# Altium project Water Heater Chip.PrjPcb
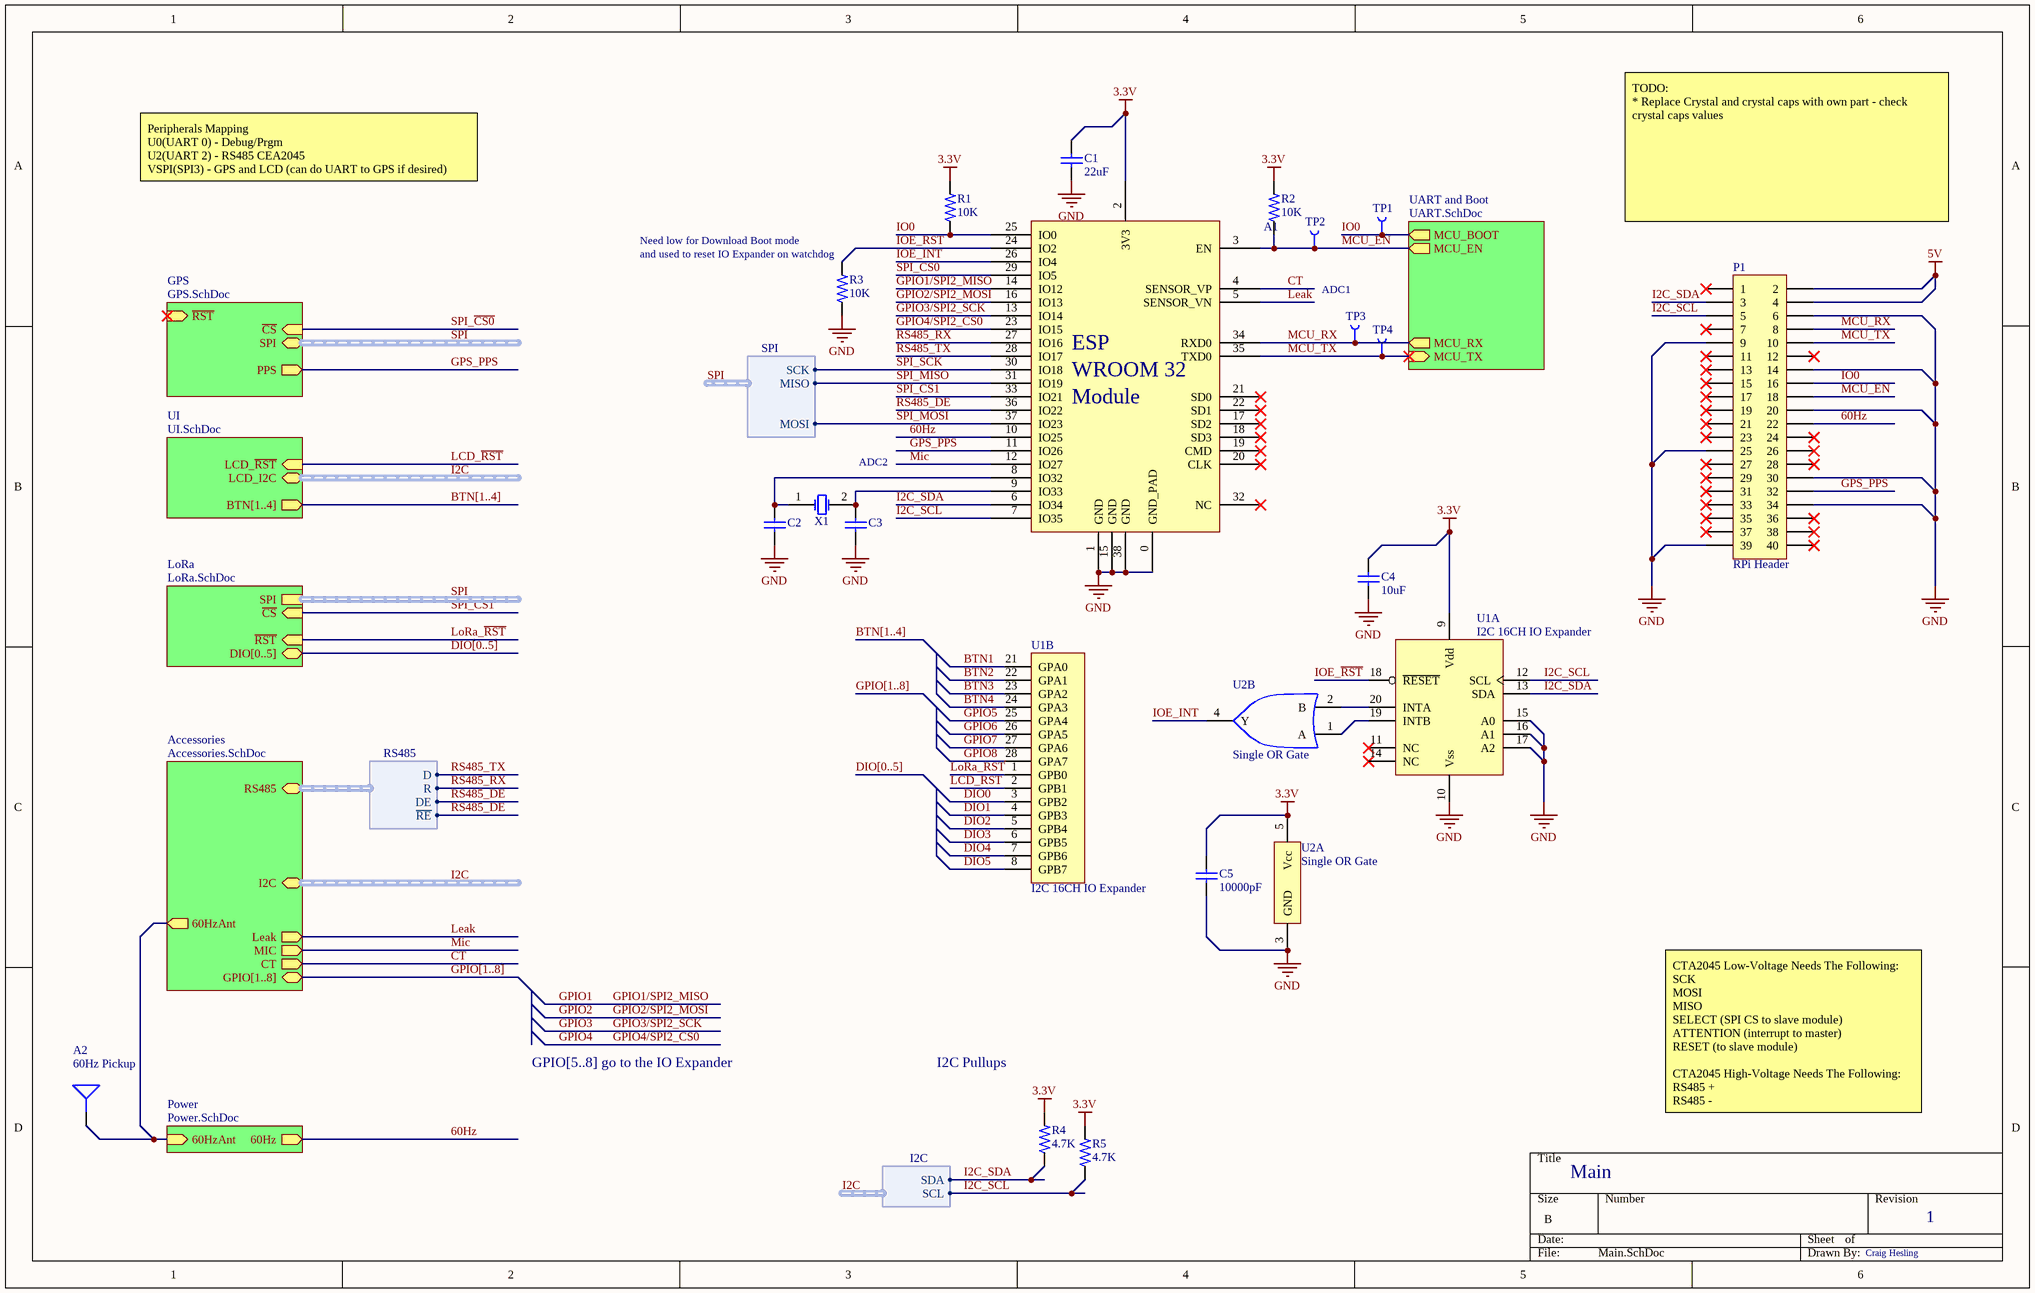
[diagram p0: Main.SchDoc]
8 sheets, 130 parts. Net scope: hierarchical (ports join the sheet entries above them; power ports are global).
Board file: PCB.PcbDoc
Sheets:
  Main.SchDoc
    GPS = GPS.SchDoc
    UART and Boot = UART.SchDoc
    Power = Power.SchDoc
    Accessories = Accessories.SchDoc
    UI = UI.SchDoc
    LoRa = LoRa.SchDoc
  RelayBoard.SchDoc

## Sheet Main.SchDoc: Main
size B; Author: Craig Hesling; DrawnBy: Craig Hesling; Revision: 1; SheetNumber: 1; SheetTotal: 7

### Parts
(Parts that share a designator on the sheet are numbered #1, #2 ... from top to bottom, then left to right.)
A1  ESP-WROOM-32  [ESP-WROOM-32]  (value not drawn)
A2  60Hz Pickup  [60HzPickup]
C1  22uF  [CAPC2013X14L - CAP0805 1.45mm Tall]
C2  CAP 12pF 16V 0603(1608)  [CAPC0603(1608)100_M]  (value not drawn)
C3  CAP 12pF 16V 0603(1608)  [CAPC0603(1608)100_M]  (value not drawn)
C4  10uF  [CAPC2013X14L - CAP0805 1.45mm Tall]
C5  10000pF  [CAPC1608X09L - CAP0603]
P1  RPi Header  [HDR2X20]
R1#1  10K  [RESC1608X06L - RES0603]
R2#1  10K  [RESC1608X06L - RES0603]
R3  10K  [RESC1608X06L - RES0603]
R4  4.7K  [RESC1608X06L - RES0603]
R5  4.7K  [RESC1608X06L - RES0603]
TP1  Test Point  [TestPoint1]  (value not drawn)
TP2  Test Point  [TestPoint1]  (value not drawn)
TP3  Test Point  [TestPoint1]  (value not drawn)
TP4  Test Point  [TestPoint1]  (value not drawn)
U1  I2C 16CH IO Expander  [SOIC127P1030X265-28L]  (parts A,B of 2)
U2  Single OR Gate  [SOT95P280X140-5L]  (parts A,B of 2)
X1  14340272-32.768KHz  [ITTI-14340272-32.768KHz-2_V]  (value not drawn)

### Sub-sheets
Accessories = Accessories.SchDoc: Leak (out), MIC (out), CT (out), I2C (harness I2C), GPIO[1..8] (bidir), RS485 (harness RS485), 60HzAnt (out)
GPS = GPS.SchDoc: SPI (harness SPI), ~{CS} (in), PPS (out), ~{RST} (in)
LoRa = LoRa.SchDoc: DIO[0..5] (bidir), SPI (harness SPI), ~{CS} (in), ~{RST} (in)
Power = Power.SchDoc: 60Hz (out), 60HzAnt (in)
UART and Boot = UART.SchDoc: MCU_EN (out), MCU_BOOT (out), MCU_RX (out), MCU_TX (in)
UI = UI.SchDoc: BTN[1..4] (out), LCD_~{RST} (in), LCD_I2C (harness I2C)

### Harnesses
SPI: MISO, MOSI, SCK
RS485: R, ~{RE}, DE, D
I2C: SDA, SCL

### Nets
3.3V: A1.2(3V3) C1.2 C4.2 C5.2 R1#1.2 R2#1.2 R4.2 R5.2 U1.9(Vdd) U2.5(Vcc)  [project net BS1]
5V: P1.2 P1.4
GND: A1.0(GND_PAD) A1.1(GND) A1.15(GND) A1.38(GND) C1.1 C2.1 C3.1 C4.1 C5.1 P1.6 P1.9 P1.14 P1.20 P1.25 P1.30 P1.34 P1.39 R3.1 U1.10(Vss) U1.15(A0) U1.16(A1) U1.17(A2) U2.3(GND)  [project net BS2]
60Hz: A1.10(IO25) P1.22 ; sheet Power/60Hz
60HzAnt: A2.1(Ant) ; sheet Power/60HzAnt, sheet Accessories/60HzAnt
BTN1: U1.21(GPA0)
BTN2: U1.22(GPA1)
BTN3: U1.23(GPA2)
BTN4: U1.24(GPA3)
CT: A1.4(SENSOR_VP) ; sheet Accessories/CT
DIO0: U1.3(GPB2)
DIO1: U1.4(GPB3)
DIO2: U1.5(GPB4)
DIO3: U1.6(GPB5)
DIO4: U1.7(GPB6)
DIO5: U1.8(GPB7)
GPIO1: A1.14(IO12)  [also labelled GPIO1/SPI2_MISO]
GPIO2: A1.16(IO13)  [also labelled GPIO2/SPI2_MOSI]
GPIO3: A1.13(IO14)  [also labelled GPIO3/SPI2_SCK]
GPIO4: A1.23(IO15)  [also labelled GPIO4/SPI2_~{CS0}]
GPIO5: U1.25(GPA4)
GPIO6: U1.26(GPA5)
GPIO7: U1.27(GPA6)
GPIO8: U1.28(GPA7)
GPS_PPS: A1.11(IO26) P1.32 ; sheet GPS/PPS
I2C_SCL: A1.7(IO35) P1.5 R5.1 U1.12(SCL) ; sheet Accessories/I2C.SCL  [project net D0]
I2C_SDA: A1.6(IO34) P1.3 R4.1 U1.13(SDA) ; sheet Accessories/I2C.SDA  [project net D1]
IO0: A1.25(IO0) P1.16 R1#1.1 TP1.1(P1) ; sheet UART and Boot/MCU_BOOT
IOE_INT: A1.26(IO4) U2.4(Y)
IOE_~{RST}: A1.24(IO2) R3.2 U1.18(~{RESET})
LCD_~{RST}: U1.2(GPB1) ; sheet UI/LCD_~{RST}
Leak: A1.5(SENSOR_VN) ; sheet Accessories/Leak
LoRa_~{RST}: U1.1(GPB0) ; sheet LoRa/~{RST}
MCU_EN: A1.3(EN) P1.18 R2#1.1 TP2.1(P1) ; sheet UART and Boot/MCU_EN
MCU_RX: A1.34(RXD0) P1.8 TP3.1(P1) ; sheet UART and Boot/MCU_RX  [project net FTDI_TX]
MCU_TX: A1.35(TXD0) P1.10 TP4.1(P1) ; sheet UART and Boot/MCU_TX  [project net FTDI_RX]
Mic: A1.12(IO27) ; sheet Accessories/MIC
RS485_DE: A1.36(IO22) ; sheet Accessories/RS485.~{RE}, sheet Accessories/RS485.DE  [project net RS485.DE]
RS485_RX: A1.27(IO16) ; sheet Accessories/RS485.R  [project net RS485.R]
RS485_TX: A1.28(IO17) ; sheet Accessories/RS485.D  [project net RS485.D]
SPI_~{CS0}: A1.29(IO5) ; sheet GPS/~{CS}  [project net ~{CS}]
SPI_~{CS1}: A1.33(IO21) ; sheet LoRa/~{CS}
SPI_MISO: A1.31(IO19) ; sheet GPS/SPI.MISO  [project net MISO]
SPI_MOSI: A1.37(IO23) ; sheet GPS/SPI.MOSI  [project net MOSI]
SPI_SCK: A1.30(IO18) ; sheet GPS/SPI.SCK  [project net SCK]
NetA1_8: A1.8(IO32) C2.2 X1.1(X1)
NetA1_9: A1.9(IO33) C3.2 X1.2(X2)
NetU1_19: U1.19(INTB) U2.1(A)
NetU1_20: U1.20(INTA) U2.2(B)

Not connected (* = marked no-connect by the designer): A1 17(SD2)* 18(SD3)* 19(CMD)* 20(CLK)* 21(SD0)* 22(SD1)* 32(NC)*; P1 1* 7* 11* 12* 13* 15* 17* 19* 21* 23* 24* 26* 27* 28* 29* 31* 33* 35* 36* 37* 38* 40*; U1 11(NC)* 14(NC)*

### Buses and harness runs
bus BTN[1..4]
bus BTN[1..4] = sheet UI/BTN[1..4]
bus DIO[0..5]
bus DIO[0..5] = sheet LoRa/DIO[0..5]
bus GPIO[1..8]
bus GPIO[1..8] = sheet Accessories/GPIO[1..8]
harness I2C = sheet Accessories/I2C
harness I2C = sheet UI/LCD_I2C
harness SPI = sheet GPS/SPI
harness SPI = sheet LoRa/SPI

### Notes on the sheet
- Peripherals Mapping
  U0(UART 0) - Debug/Prgm
  U2(UART 2) - RS485 CEA2045
  VSPI(SPI3) - GPS and LCD (can do UART to GPS if desired)
  HSPI/HS2(Host SD 2) - SD Card
- TODO:
  * Replace Crystal and crystal caps with own part - check crystal caps values
- (near R3) Need low for Download Boot mode
- (near R3) and used to reset IO Expander on watchdog
- ADC1
- ADC2
- GPIO[5..8] go to the IO Expander
- I2C Pullups
- CTA2045 Low-Voltage Needs The Following:
  SCK
  MOSI
  MISO
  SELECT (SPI CS to slave module)
  ATTENTION (interrupt to master)
  RESET (to slave module)
  CTA2045 High-Voltage Needs The Following:
  RS485 +
  RS485 -
- (in symbol ESP-WROOM-32) ESP; WROOM 32; Module

### Library data of the parts
A1 = ESP-WROOM-32: ESP WROOM 32 Module; Supplier 1: Digi-Key; Supplier Part Number 1: 1528-1801-ND
A2 = 60Hz pickup with via: 5cm 60Hz pickup antenna with via for external wire
C1 = CAP0805 22uF 10% 6.3V X5R: SMT 0805 Ceramic Capacitor; TempCoeff: X5R; Tolerance: 10%; Voltage: 6.3V; Value: 22uF; Supplier 1: Digi-Key; Supplier Part Number 1: 1276-6687-1-ND; Supplier 2: Digi-Key; Supplier Part Number 2: 311-1860-1-ND
C2 C3 = CMP-1035-00607-1: CAP 12pF 16V ±10% 0603 (1608 Metric) Thickness 1mm SMD; Case-Metric: 1608; Tolerance: Â±10%; Case-EIA: 0603; Value: 12pF; Max Thickness: 1 mm; Technology: SMT; Rated Voltage: 16 V
C4 = CAP0805 10uF 10% 6.3V X5R: SMT 0805 Ceramic Capacitor; TempCoeff: X5R; Tolerance: 10%; Voltage: 6.3V; Value: 10uF; Supplier 1: Digi-Key; Supplier Part Number 1: 1276-6457-1-ND
C5 = CAP0603 10000pF 10% 50V X7R: SMT 0603 Ceramic Capacitor; TempCoeff: X7R; Tolerance: 10%; Voltage: 50V; Value: 10000pF; Supplier 1: Digi-Key; Supplier 2: Digi-Key; Supplier 3: Digi-Key; Supplier Part Number 1: 478-1215-1-ND; Supplier Part Number 2: 311-1080-1-ND; Supplier Part Number 3: 490-1494-1-ND
P1 = Header 20X2: Header, 20-Pin, Dual row; LatestRevisionDate: 17-Jul-2002; LatestRevisionNote: Re-released for DXP Platform.; Publisher: Altium Limited
R1#1 R2#1 R3 = RES0603 10K 1% 1/10W: SMT 0603 Ceramic Resistor; Power: 1/10W; Tolerance: 1%; Supplier 1: Digi-Key; Supplier 2: Digi-Key; Supplier 3: Digi-Key; Supplier Part Number 1: 311-10.0KHRCT-ND; Supplier Part Number 2: RMCF0603FT10K0CT-ND; Supplier Part Number 3: P10.0KHCT-ND; Value: 10K
R4 R5 = RES0603 4.7K 1% 1/10W: SMT 0603 Ceramic Resistor; Power: 1/10W; Tolerance: 1%; Value: 4.7K; Supplier 1: Digi-Key; Supplier 2: Digi-Key; Supplier 3: Digi-Key; Supplier Part Number 1: 311-4.70KHRCT-ND; Supplier Part Number 2: P4.70KHCT-ND; Supplier Part Number 3: RMCF0603FT4K70CT-ND
TP1-TP4 = TestPoint1: Small 0.762mm Round Test Point
U1 = MCP23017T-E/SO: Microchip MCP23017 I2C 16CH IO Expander; Supplier 1: Digi-Key; Supplier Part Number 1: MCP23017T-E/SOCT-ND
U2 = NC7S32M5X: Fairchild/ON Semi NC7S32M5X Single OR Gate; Supplier 1: Digi-Key; Supplier Part Number 1: NC7S32M5XCT-ND
X1 = CMP-0463-00001-2: Crystal, 32.768 KHz, -40 to 85 degC, 3.2 x 1.5 x 0.9 mm SMD; Manufacturer: ITTI; Load Capacitance: 12.5 pF; Frequency Tolerance: +/-20 ppm; Drive Level: 1 max. uw; Nominal Frequency: 32.768KHz; Mounting Technology: Surface Mount; Operating temperature: -40 to 85 degC; PartNumber: 14340272-32.768KHz; ComponentLink1URL: http://www.itti-co.com; ComponentLink1Description: Manufacturer URL; PackageReference: 14340272-32.768KHz-2; PackageDescription: 2-Pin Hand Drawn, Body 3.2 x 1.5mm, Pitch 2.5 mm

## Sheet GPS.SchDoc: GPS
size A; Author: Craig Hesling; DrawnBy: Craig Hesling; Revision: 1
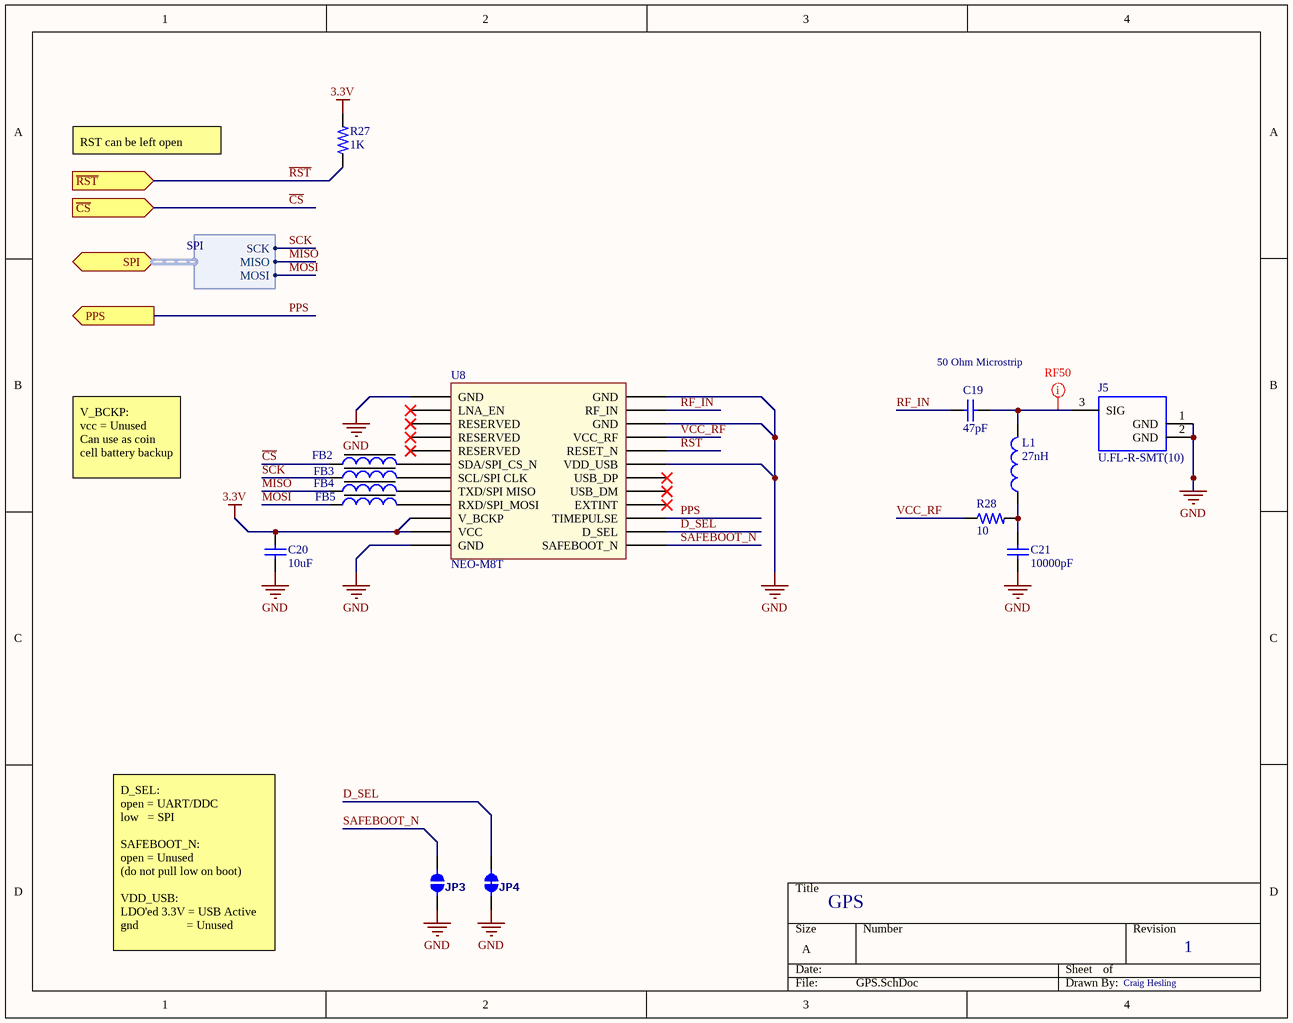
[diagram p1: GPS.SchDoc]

### Parts
C19  47pF  [CAPC1608X09L - CAP0603]
C20  10uF  [CAPC2013X14L - CAP0805 1.45mm Tall]
C21  10000pF  [CAPC1608X09L - CAP0603]
FB2  Feritte Bead 1kOhm  [FB1608X09L]  (value not drawn)
FB3  Feritte Bead 1kOhm  [FB1608X09L]  (value not drawn)
FB4  Feritte Bead 1kOhm  [FB1608X09L]  (value not drawn)
FB5  Feritte Bead 1kOhm  [FB1608X09L]  (value not drawn)
J5  U.FL-R-SMT(10)  [HRS-U.FL-R-SMT_V]
JP3  JUMPER-PAD-2-NO  [PAD-JUMPER-2-NO_NO_SILK]  (value not drawn)
JP4  JUMPER-PAD-2-NC_BY_TRACENO_SILK  [PAD-JUMPER-2-NC_BY_TRACE_NO_SILK]  (value not drawn)
L1  27nH  [INDC1608X09L - IND0603 0.95MM TALL]
R27  1K  [RESC1608X06L - RES0603]
R28  10  [RESC1608X06L - RES0603]
U8  NEO-M8T  [NEO]

### Ports
PPS (out), SPI (harness SPI), ~{CS} (in), ~{RST} (in)

### Harnesses
SPI: MISO, MOSI, SCK

### Nets
3.3V: C20.2 R27.2 U8.22(V_BCKP) U8.23(VCC)  [project net BS1]
GND: C20.1 C21.1 J5.1(GND) J5.2(GND) JP3.1 JP4.1 U8.7(VDD_USB) U8.10(GND) U8.12(GND) U8.13(GND) U8.24(GND)  [project net BS2]
~{CS}: FB2.1 ; port ~{CS}
D_SEL: JP4.2 U8.2(D_SEL)
MISO: FB4.1 ; port SPI.MISO
MOSI: FB5.1 ; port SPI.MOSI
PPS: U8.3(TIMEPULSE) ; port PPS  [project net GPS_PPS]
~{RST}: R27.1 U8.8(RESET_N) ; port ~{RST}
RF_IN: C19.1 U8.11(RF_IN)
SAFEBOOT_N: JP3.2 U8.1(SAFEBOOT_N)
SCK: FB3.1 ; port SPI.SCK
VCC_RF: R28.1 U8.9(VCC_RF)
NetC19_2: C19.2 J5.3(SIG) L1.2
NetC21_2: C21.2 L1.1 R28.2
NetFB2_2: FB2.2 U8.18(SDA/SPI_CS_N)
NetFB3_2: FB3.2 U8.19(SCL/SPI_CLK)
NetFB4_2: FB4.2 U8.20(TXD/SPI_MISO)
NetFB5_2: FB5.2 U8.21(RXD/SPI_MOSI)

Not connected (* = marked no-connect by the designer): U8 4(EXTINT)* 5(USB_DM)* 6(USB_DP)* 14(LNA_EN)* 15(RESERVED)* 16(RESERVED)* 17(RESERVED)*

### Layout directives
net class RF50: NetC19_2

### Notes on the sheet
- RST can be left open
- (near C19) 50 Ohm Microstrip
- V_BCKP:
  vcc = Unused
  Can use as coin cell battery backup
- D_SEL:
  open = UART/DDC
  low   = SPI
  SAFEBOOT_N:
  open = Unused
  (do not pull low on boot)
  VDD_USB:
  LDO'ed 3.3V = USB Active
  gnd                = Unused

### Library data of the parts
C19 = CAP0603 47pF 5% 50V NP0: SMT 0603 Ceramic Capacitor; TempCoeff: NP0; Tolerance: 5%; Voltage: 50V; Value: 47pF; Supplier 1: Digi-Key; Supplier 2: Digi-Key; Supplier 3: Arrow; Supplier 4: Digi-Key; Supplier Part Number 1: 1276-1037-1-ND; Supplier Part Number 2: 1276-2296-1-ND; Supplier Part Number 3: CFabNzdY6X6BB7Ej2OVMNUmEE8oTDHVGVspzp79aHa0; Supplier Part Number 4: 399-1056-1-ND
C20 = CAP0805 10uF 10% 6.3V X5R: as C4 on sheet Main; Value: 10uF; Supplier 1: Digi-Key; Supplier Part Number 1: 1276-6457-1-ND
C21 = CAP0603 10000pF 10% 50V X7R: as C5 on sheet Main; Value: 10000pF; Supplier 1: Digi-Key; Supplier 2: Digi-Key; Supplier 3: Digi-Key; Supplier Part Number 1: 478-1215-1-ND; Supplier Part Number 2: 311-1080-1-ND; Supplier Part Number 3: 490-1494-1-ND
FB2-FB5 = FB0603 1kOhm: Impedance at 100MHz: 1kOhms; Supplier 1: Digi-Key; Supplier Part Number 1: 490-1015-1-ND
J5 = CMP-0029-00003-1: Ultra Small Surface Mount Coaxial Connector, 50 Ohm, -40 to 90 degC, 3-Pin SMD, RoHS, Tape and Reel; Current Rating: 3 A; DatasheetVersion: Aug-16; Mount: Through Hole; Contact Material: Bronze; Length: 101.19 mm; Radiation Hardening: No; Height: 8.13 mm; ComponentLink1Description: Manufacturer URL; Pins: 80; Package Quantity: 50; ComponentLink2URL: https://www.hirose.com/product/en/download_file/key_name/U.FL/category/Catalog/doc_file_id/31697/?file_category_id=4&item_id=15&is_series=1; Lead Pitch: 2.54 mm; Max Operating Temperature: 105degC; Width: 4.88 mm; RoHSCompliant: True; Contact Plating: Tin; PackageReference: U.FL-R-SMT; Packaging: Bulk; Contact Finish: Lead; PackageDescription: 3-Pin Surface Mount Device, Body 2.6 x 2.6 mm; Min Operating Temperature: -65degC; ComponentLink1URL: https://www.hirose.com; ComponentLink2Description: Datasheet; Colour: Black
L1 = IND0603 27nH 400mA 5% 650mOhm 1.7GHz: SMT 0603 Ceramic Inductor; Tolerance: 5%; Current Rating: 300mA; DC Resistance: 450mOhm; Self Resonant: 1.7GHz; Value: 27nH; Supplier 1: Digi-Key; Supplier Part Number 1: 732-6268-1-ND
R27 = RES0603 1K 1% 1/10W: SMT 0603 Ceramic Resistor; Power: 1/10W; Tolerance: 1%; Value: 1K; Supplier 1: Digi-Key; Supplier 2: Digi-Key; Supplier 3: Digi-Key; Supplier Part Number 1: 311-1.00KHRCT-ND; Supplier Part Number 2: P1.00KHCT-ND; Supplier Part Number 3: RMCF0603FG1K00CT-ND
R28 = RES0603 10 1% 1/10W: SMT 0603 Ceramic Resistor; Power: 1/10W; Tolerance: 1%; Value: 10; Supplier 1: Digi-Key; Supplier 2: Digi-Key; Supplier 3: Digi-Key; Supplier Part Number 1: 311-10.0HRCT-ND; Supplier Part Number 2: RMCF0603FT10R0CT-ND; Supplier Part Number 3: CR0603-FX-10R0ELFCT-ND
U8 = NEO: u-blox NEO GNSS module; Part Description: u-blox GNSS module; Value: NEO-M8; Manufacturer: u-blox

## Sheet UART.SchDoc: UART
size A; DrawnBy: Craig Hesling; Revision: 2
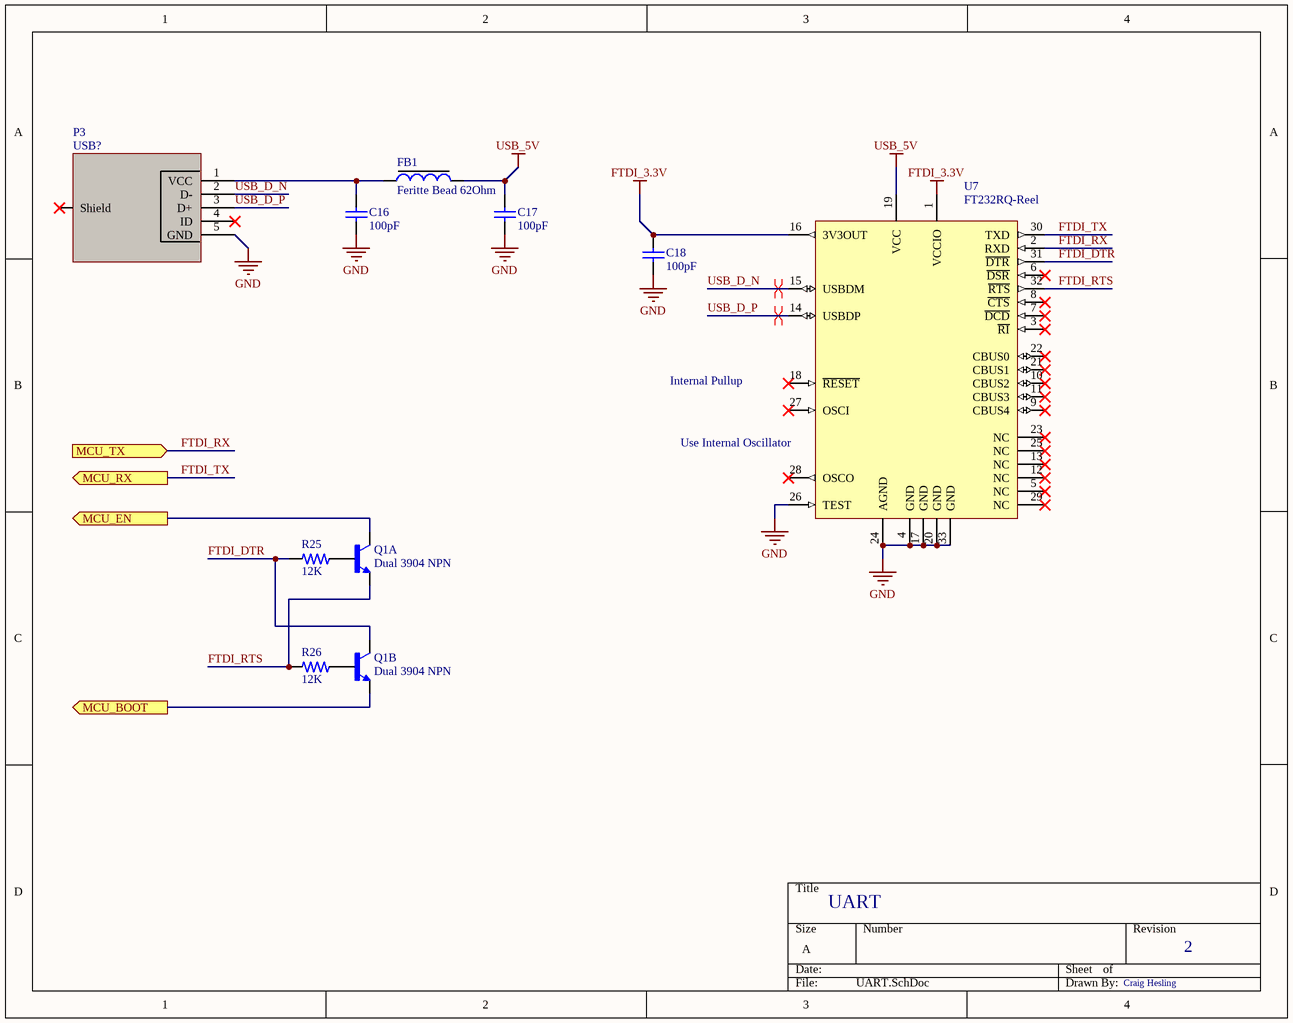
[diagram p2: UART.SchDoc]

### Parts
(Parts that share a designator on the sheet are numbered #1, #2 ... from top to bottom, then left to right.)
C16  100pF  [CAPC1608X09L - CAP0603]
C17  100pF  [CAPC1608X09L - CAP0603]
C18  100pF  [CAPC1608X09L - CAP0603]
FB1  Feritte Bead 62Ohm  [INDC1608X10L - FL0603]
P3  USB?  [MicroUSB_TypeB]
Q1#1  Dual 3904 NPN  [SOT65P210X110-6L]  (parts A,B of 2)
R25  12K  [RESC1608X06L - RES0603]
R26  12K  [RESC1608X06L - RES0603]
U7  FT232RQ-Reel  [PQFN5X5-32_V_FTDI_BIG_VIAS]

### Ports
MCU_BOOT (out), MCU_EN (out), MCU_RX (out), MCU_TX (in)

### Nets
FTDI_3.3V: C18.2 U7.1(VCCIO) U7.16(3V3OUT)
GND: C16.1 C17.1 C18.1 P3.5(GND) U7.4(GND) U7.17(GND) U7.20(GND) U7.24(AGND) U7.26(TEST) U7.33(GND)  [project net BS2]
USB_5V: C17.2 FB1.2 U7.19(VCC)
FTDI_DTR: Q1#1.6(C2) R25.2 U7.31(~{DTR})
FTDI_RTS: Q1#1.4(E1) R26.2 U7.32(~{RTS})
FTDI_RX: U7.2(RXD) ; port MCU_TX
FTDI_TX: U7.30(TXD) ; port MCU_RX
IO0: Q1#1.1(E2) ; port MCU_BOOT
MCU_EN: Q1#1.3(C1) ; port MCU_EN
USB_D_N: P3.2(D-) U7.15(USBDM)
USB_D_P: P3.3(D+) U7.14(USBDP)
NetC16_2: C16.2 FB1.1 P3.1(VCC)
NetQ1#1_2: Q1#1.2(B2) R26.1
NetQ1#1_5: Q1#1.5(B1) R25.1

Not connected (* = marked no-connect by the designer): P3 0(Shield)* 4(ID)*; U7 3(~{RI})* 5(NC)* 6(~{DSR})* 7(~{DCD})* 8(~{CTS})* 9(CBUS4)* 10(CBUS2)* 11(CBUS3)* 12(NC)* 13(NC)* 18(~{RESET})* 21(CBUS1)* 22(CBUS0)* 23(NC)* 25(NC)* 27(OSCI)* 28(OSCO)* 29(NC)*

### Layout directives
differential pair: USB_D_N, USB_D_P

### Notes on the sheet
- Internal Pullup
- (near U7) Use Internal Oscillator

### Library data of the parts
C16-C18 = CAP0603 100pF 5% 50V NP0: SMT 0603 Ceramic Capacitor; TempCoeff: NP0; Tolerance: 5%; Voltage: 50V; Value: 100pF; Supplier 1: Digi-Key; Supplier 2: Digi-Key; Supplier Part Number 1: 399-1061-1-ND; Supplier Part Number 2: 490-1427-1-ND
FB1 = FB0603 62Ohm: Impedance at 100MHz: 62Ohms; Supplier 1: Digi-Key; Supplier Part Number 1: 732-6702-1-ND
P3 = MicroUSB TypeB: Micro USB Type B Port; Supplier: http://www.digikey.com/product-detail/en/amphenol-fci/10118192-0001LF/609-4613-2-ND/2785387; Datasheet: http://portal.fciconnect.com/Comergent//fci/drawing/10118192.pdf; Supplier 1: Digi-Key; Supplier Part Number 1: 609-4613-1-ND
Q1#1 = MBT3904DW1T1G: 3904 Dual NPN Transistor; Supplier 1: Digi-Key; Supplier 2: Mouser; Supplier Part Number 1: MBT3904DW1T1GOSCT-ND; Supplier Part Number 2: 863-SMBT3904DW1T1G
R25 R26 = RES0603 12K 1% 1/10W: SMT 0603 Ceramic Resistor; Power: 1/10W; Tolerance: 1%; Value: 12K; Supplier 1: Digi-Key; Supplier 2: Digi-Key; Supplier Part Number 1: 311-12.0KHRCT-ND; Supplier Part Number 2: RMCF0603FT12K0CT-ND
U7 = FT232RQ-Reel: USB UART Asynchronous Serial Data Transfer Chip, 32-pin QFN, Tape and Reel; Manufacturer: FTDI; DatasheetVersion: ver 2.10, Mar-2012; PackageVersion: Mar-12; PackageReference: PQFN5X5-32; PackageDescription: 32-Pin Quad Flat No-Lead 0.5 mm Pitch, Pullback, 3.2 x 3.2 mm Exposed Pad; PartNumber: FT232RQ-Reel; ComponentLink1Description: Manufacturer URL; ComponentLink1URL: http://www.ftdichip.com/; ComponentLink2Description: Datasheet; ComponentLink2URL: http://www.ftdichip.com/Support/Documents/DataSheets/ICs/DS_FT232R.pdf

## Sheet Power.SchDoc: Power
size A; Author: Craig Hesling; DrawnBy: Craig Hesling; Revision: 1
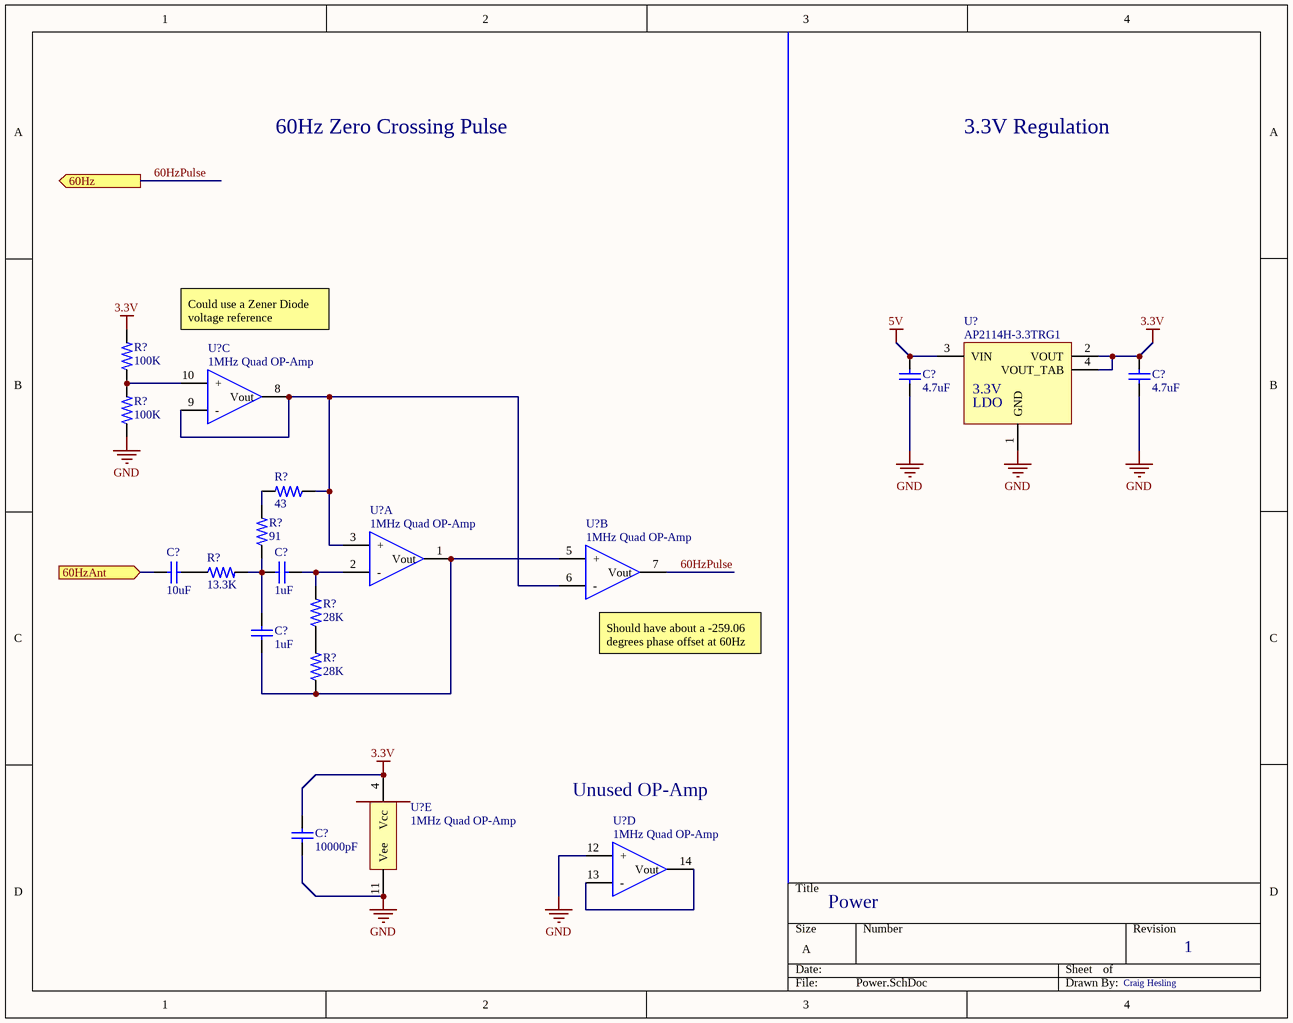
[diagram p3: Power.SchDoc]

### Parts
(Parts that share a designator on the sheet are numbered #1, #2 ... from top to bottom, then left to right.)
C?#1  4.7uF  [CAPC3216X18L - CAP1206 1.8MM TALL]
C?#2  4.7uF  [CAPC3216X18L - CAP1206 1.8MM TALL]
C?#3  10uF  [CAPC3225X28L - CAP1210 2.79mm Tall]
C?#4  1uF  [CAPC1608X09L - CAP0603]
C?#5  1uF  [CAPC1608X09L - CAP0603]
C?#6  10000pF  [CAPC1608X09L - CAP0603]
R?#1  100K  [RESC1608X06L - RES0603]
R?#2  100K  [RESC1608X06L - RES0603]
R?#3  43  [RESC1608X06L - RES0603]
R?#4  91  [RESC1608X06L - RES0603]
R?#5  13.3K  [RESC1608X06L - RES0603]
R?#6  28K  [RESC1608X06L - RES0603]
R?#7  28K  [RESC1608X06L - RES0603]
U?#1  1MHz Quad OP-Amp  [SOIC127P600X175-14L]  (part C of 5)
U?#2  AP2114H-3.3TRG1  [SOT230P700X180-4L]
U?#3  1MHz Quad OP-Amp  [SOIC127P600X175-14L]  (part A of 5)
U?#4  1MHz Quad OP-Amp  [SOIC127P600X175-14L]  (part B of 5)
U?#5  1MHz Quad OP-Amp  [SOIC127P600X175-14L]  (part E of 5)
U?#6  1MHz Quad OP-Amp  [SOIC127P600X175-14L]  (part D of 5)

### Ports
60Hz (out), 60HzAnt (in)

### Nets
3.3V: C?#2.2 C?#6.2 R?#1.2 U?#2.2(VOUT) U?#2.4(VOUT_TAB) U?#5.4(Vcc)  [project net BS1]
5V: C?#1.2 U?#2.3(VIN)
GND: C?#1.1 C?#2.1 C?#6.1 R?#2.1 U?#2.1(GND) U?#5.11(Vee) U?#6.12(+)  [project net BS2]
60HzAnt: C?#3.1 ; port 60HzAnt
60HzPulse: U?#4.7(Vout) ; port 60Hz  [project net 60Hz]
NetC?#3_2: C?#3.2 R?#5.1
NetC?#4_1: C?#4.1 R?#6.2 U?#3.2(-)
NetC?#4_2: C?#4.2 C?#5.2 R?#4.1 R?#5.2
NetC?#5_1: C?#5.1 R?#7.1 U?#3.1(Vout) U?#4.5(+)
NetR?#1_1: R?#1.1 R?#2.2 U?#1.10(+)
NetR?#3_1: R?#3.1 U?#1.8(Vout) U?#1.9(-) U?#3.3(+) U?#4.6(-)
NetR?#3_2: R?#3.2 R?#4.2
NetR?#6_1: R?#6.1 R?#7.2
NetU?#6_13: U?#6.13(-) U?#6.14(Vout)

### Notes on the sheet
- 60Hz Zero Crossing Pulse
- 3.3V Regulation
- Could use a Zener Diode voltage reference
- (near U?#4) Should have about a -259.06 degrees phase offset at 60Hz
- Unused OP-Amp
- (in symbol AP2114H-3.3TRG1) 3.3V; LDO

### Library data of the parts
C?#1 C?#2 = CAP1206 4.7uF 10% 25V X5R: SMT 1206 Ceramic Capacitor; TempCoeff: X5R; Tolerance: 10%; Voltage: 25V; Value: 4.7uF; Supplier 1: Digi-Key; Supplier Part Number 1: 587-1336-1-ND
C?#3 = CAP1210 10uF 10% 25V X7R: SMT 1210 Ceramic Capacitor; TempCoeff: X7R; Tolerance: 10%; Voltage: 25V; Value: 10uF; Supplier 1: Digi-Key; Supplier 2: Digi-Key; Supplier Part Number 1: 587-2226-1-ND; Supplier Part Number 2: 732-7708-1-ND
C?#4 C?#5 = CAP0603 1uF 10% 10V X7R: SMT 0603 Ceramic Capacitor; TempCoeff: X7R; Tolerance: 10%; Voltage: 10V; Value: 1uF; Supplier 1: Digi-Key; Supplier Part Number 1: 1276-1946-1-ND; Supplier 2: Digi-Key; Supplier Part Number 2: 399-3118-1-ND
C?#6 = CAP0603 10000pF 10% 50V X7R: as C5 on sheet Main; Value: 10000pF; Supplier 1: Digi-Key; Supplier 2: Digi-Key; Supplier 3: Digi-Key; Supplier Part Number 1: 478-1215-1-ND; Supplier Part Number 2: 311-1080-1-ND; Supplier Part Number 3: 490-1494-1-ND
R?#1 R?#2 = RES0603 100K 1% 1/10W: SMT 0603 Ceramic Resistor; Power: 1/10W; Tolerance: 1%; Value: 100K; Supplier 1: Digi-Key; Supplier Part Number 1: 311-100KHRCT-ND
R?#3 = RES0603 43 1% 1/10W: SMT 0603 Ceramic Resistor; Power: 1/10W; Tolerance: 1%; Value: 43; Supplier 1: Digi-Key; Supplier Part Number 1: 311-43.0HRCT-ND; Supplier 2: Digi-Key; Supplier Part Number 2: P43.0HCT-ND
R?#4 = RES0603 91 1% 1/10W: SMT 0603 Ceramic Resistor; Power: 1/10W; Tolerance: 1%; Value: 91; Supplier 1: Digi-Key; Supplier 2: Digi-Key; Supplier 3: Digi-Key; Supplier Part Number 1: 311-91.0HRCT-ND; Supplier Part Number 2: 541-91.0HCT-ND; Supplier Part Number 3: RHM91CFCT-ND
R?#5 = RES0603 13.3K 1% 1/10W: SMT 0603 Ceramic Resistor; Power: 1/10W; Tolerance: 1%; Value: 13.3K; Supplier 1: Digi-Key; Supplier 2: Digi-Key; Supplier Part Number 1: 311-13.3KHRCT-ND; Supplier Part Number 2: P13.3KHCT-ND
R?#6 R?#7 = RES0603 28K 0.1% 1/10W: SMT 0603 Ceramic Resistor; Power: 1/10W; Tolerance: 0.1%; Value: 28K; Supplier 1: Digi-Key; Supplier 2: Digi-Key; Supplier Part Number 1: YAG4680CT-ND; Supplier Part Number 2: P28KDBCT-ND
U?#1 U?#3-U?#6 = LM324DR2G: ON Semi LM324DR2G 1MHz Quad OP-Amp; Supplier 1: Digi-Key; Supplier Part Number 1: LM324DR2GOSCT-ND
U?#2 = AP2114H-3.3TRG1: AP2114 3.3V Fixed LDO Regulator; Supplier 1: Digi-Key; Supplier Part Number 1: AP2114H-3.3TRG1DICT-ND

## Sheet Accessories.SchDoc: Accessories
size B; Author: Craig Hesling; DrawnBy: Craig Hesling; Revision: 1
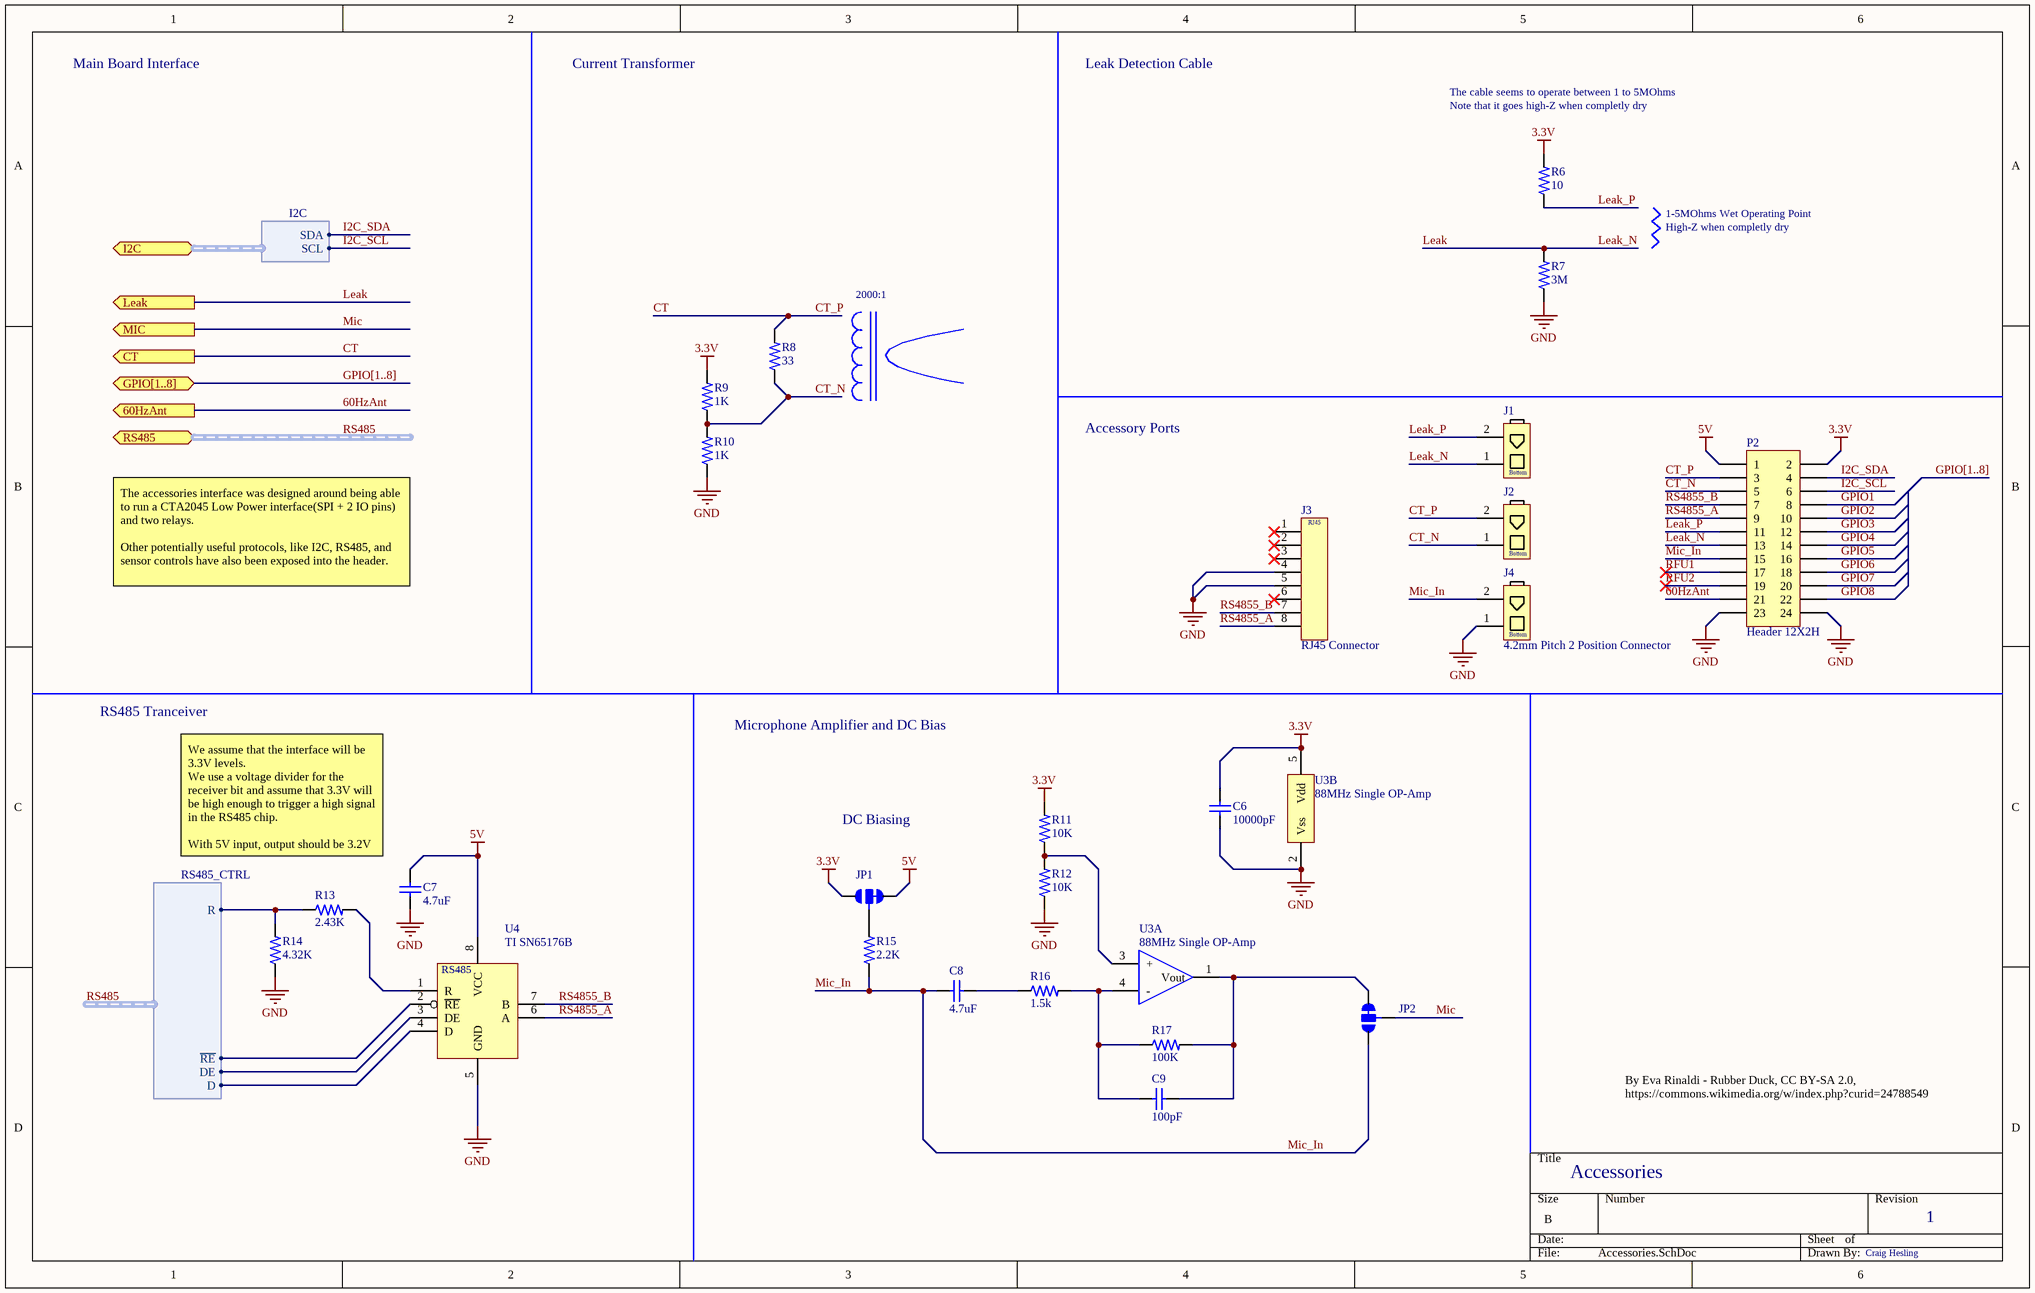
[diagram p4: Accessories.SchDoc]

### Parts
C6  10000pF  [CAPC1608X09L - CAP0603]
C7  4.7uF  [CAPC1608X09L - CAP0603]
C8  4.7uF  [CAPC1608X09L - CAP0603]
C9  100pF  [CAPC1608X09L - CAP0603]
J1  4.2mm Pitch 2 Position Connector  [2POS 4.2MM PITCH RIGHT ANGLE]  (value not drawn)
J2  4.2mm Pitch 2 Position Connector  [2POS 4.2MM PITCH RIGHT ANGLE]  (value not drawn)
J3  RJ45 Connector  [RJ45 Unshielded PTH Connector]
J4  4.2mm Pitch 2 Position Connector  [2POS 4.2MM PITCH RIGHT ANGLE]
JP1  JUMPER-PAD-3-2OF3_NC_BY_TRACE_SMALL  [PAD-JUMPER-3-2OF3_NC_BY_TRACE_YES_SILK_FULL_BOX]  (value not drawn)
JP2  JUMPER-PAD-3-2OF3_NC_BY_TRACE_SMALL  [PAD-JUMPER-3-2OF3_NC_BY_TRACE_YES_SILK_FULL_BOX]  (value not drawn)
P2  Header 12X2H  [HDR2X12H]
R6  10  [RESC1608X06L - RES0603]
R7  3M  [RESC1608X06L - RES0603]
R8  33  [RESC1608X06L - RES0603]
R9  1K  [RESC1608X06L - RES0603]
R10  1K  [RESC1608X06L - RES0603]
R11  10K  [RESC1608X06L - RES0603]
R12  10K  [RESC1608X06L - RES0603]
R13  2.43K  [RESC1608X06L - RES0603]
R14  4.32K  [RESC1608X06L - RES0603]
R15  2.2K  [RESC1608X06L - RES0603]
R16  1.5k  [RESC1608X06L - RES0603]
R17  100K  [RESC1608X06L - RES0603]
U3  88MHz Single OP-Amp  [SOT95P280X145-5L]  (parts A,B of 2)
U4  TI SN65176B  [SOIC127P600X175-8L]

### Ports
60HzAnt (out), CT (out), GPIO[1..8] (bidir), I2C (harness I2C), Leak (out), MIC (out), RS485 (harness RS485_CTRL)

### Harnesses
I2C: SDA, SCL
RS485_CTRL: R, ~{RE}, DE, D

### Nets
3.3V: C6.2 JP1.1 P2.2 R6.2 R9.2 R11.2 U3.5(Vdd)  [project net BS1]
5V: C7.2 JP1.3 P2.1 U4.8(VCC)
GND: C6.1 C7.1 J3.4 J3.5 J4.1(Bottom) P2.23 P2.24 R7.1 R10.1 R12.1 R14.1 U3.2(Vss) U4.5(GND)  [project net BS2]
60HzAnt: P2.21 ; port 60HzAnt
CT: J2.2(Top) P2.3 R8.2 ; port CT  [also labelled CT_P]
CT_N: J2.1(Bottom) P2.5 R8.1 R9.1 R10.2
GPIO1: P2.8
GPIO2: P2.10
GPIO3: P2.12
GPIO4: P2.14
GPIO5: P2.16
GPIO6: P2.18
GPIO7: P2.20
GPIO8: P2.22
I2C_SCL: P2.6 ; port I2C.SCL  [project net D0]
I2C_SDA: P2.4 ; port I2C.SDA  [project net D1]
Leak: J1.1(Bottom) P2.13 R7.2 ; port Leak  [also labelled Leak_N]
Leak_P: J1.2(Top) P2.11 R6.1
Mic: JP2.2 ; port MIC
Mic_In: C8.1 J4.2(Top) JP2.1 P2.15 R15.1
RFU1: P2.17
RFU2: P2.19
RS485.D: U4.4(D) ; port RS485.D
RS485.DE: U4.2(~{RE}) U4.3(DE) ; port RS485.~{RE}, port RS485.DE
RS485.R: R13.1 R14.2 ; port RS485.R
RS4855_A: J3.8 P2.9 U4.6(A)
RS4855_B: J3.7 P2.7 U4.7(B)
NetC8_2: C8.2 R16.1
NetC9_1: C9.1 R16.2 R17.1 U3.4(-)
NetC9_2: C9.2 JP2.3 R17.2 U3.1(Vout)
NetJP1_2: JP1.2 R15.2
NetR11_1: R11.1 R12.2 U3.3(+)
NetR13_2: R13.2 U4.1(R)

Not connected (* = marked no-connect by the designer): J3 1* 2* 3* 6*

### Buses and harness runs
bus GPIO[1..8]
bus GPIO[1..8] = port GPIO[1..8]
harness RS485 = port RS485

### Notes on the sheet
- Main Board Interface
- Current Transformer
- Leak Detection Cable
- The cable seems to operate between 1 to 5MOhms
- Note that it goes high-Z when completly dry
- 1-5MOhms Wet Operating Point
- High-Z when completly dry
- 2000:1
- Accessory Ports
- The accessories interface was designed around being able to run a CTA2045 Low Power interface(SPI + 2 IO pins) and two relays.
  Other potentially useful protocols, like I2C, RS485, and sensor controls have also been exposed into the header.
- RS485 Tranceiver
- Microphone Amplifier and DC Bias
- DC Biasing
- We assume that the interface will be 3.3V levels.
  We use a voltage divider for the receiver bit and assume that 3.3V will be high enough to trigger a high signal in the RS485 chip.
  With 5V input, output should be 3.2V at 0A
- By Eva Rinaldi - Rubber Duck, CC BY-SA 2.0, https://commons.wikimedia.org/w/index.php?curid=24788549
- (in symbol RJ45 Unshielded PTH Connector) RJ45
- (in symbol SN65176B) RS485

### Library data of the parts
C6 = CAP0603 10000pF 10% 50V X7R: as C5 on sheet Main; Value: 10000pF; Supplier 1: Digi-Key; Supplier 2: Digi-Key; Supplier 3: Digi-Key; Supplier Part Number 1: 478-1215-1-ND; Supplier Part Number 2: 311-1080-1-ND; Supplier Part Number 3: 490-1494-1-ND
C7 C8 = CAP0603 4.7uF 10% 6.3V X7R: SMT 0603 Ceramic Capacitor; TempCoeff: X7R; Tolerance: 10%; Voltage: 6.3V; Value: 4.7uF; Supplier 1: Digi-Key; Supplier Part Number 1: 1276-2087-1-ND
C9 = CAP0603 100pF 5% 50V NP0: as C16 on sheet UART; Value: 100pF; Supplier 1: Digi-Key; Supplier 2: Digi-Key; Supplier Part Number 1: 399-1061-1-ND; Supplier Part Number 2: 490-1427-1-ND
J1 J2 J4 = 2POS 4.2mm Pitch Right Angle: TE 1586043-2 - 2position 4.2mm pitch right angle with screw support; Positions: 2; Supplier 1: Digi-Key; Supplier Part Number 1: A30626-ND
J3 = RJ45 Unshielded PTH Connector: Amphenol RJ45 Unshielded Through-Hole Connector; Supplier 1: Digi-Key; Supplier Part Number 1: 609-5081-ND
P2 = Header 12X2H: Header, 12-Pin, Dual row, Right Angle; LatestRevisionDate: 17-Jul-2002; LatestRevisionNote: Re-released for DXP Platform.; Publisher: Altium Limited
R6 = RES0603 10 1% 1/10W: as R28 on sheet GPS; Value: 10; Supplier 1: Digi-Key; Supplier 2: Digi-Key; Supplier 3: Digi-Key; Supplier Part Number 1: 311-10.0HRCT-ND; Supplier Part Number 2: RMCF0603FT10R0CT-ND; Supplier Part Number 3: CR0603-FX-10R0ELFCT-ND
R7 = RES0603 3M 1% 1/10W: SMT 0603 Ceramic Resistor; Tolerance: 1%; Power: 1/10W; Value: 3M; Supplier 1: Digi-Key; Supplier 2: Digi-Key; Supplier 3: Digi-Key; Supplier Part Number 1: 541-3.00MHCT-ND; Supplier Part Number 2: RMCF0603FT3M00CT-ND; Supplier Part Number 3: 1276-4958-1-ND
R8 = RES0603 33 1% 1/10W: SMT 0603 Ceramic Resistor; Power: 1/10W; Tolerance: 1%; Value: 33; Supplier 1: Digi-Key; Supplier 2: Digi-Key; Supplier 3: Digi-Key; Supplier Part Number 1: 311-33.0HRCT-ND; Supplier Part Number 2: RMCF0603FT33R0CT-ND; Supplier Part Number 3: P33.0HCT-ND
R9 R10 = RES0603 1K 1% 1/10W: as R27 on sheet GPS; Value: 1K; Supplier 1: Digi-Key; Supplier 2: Digi-Key; Supplier 3: Digi-Key; Supplier Part Number 1: 311-1.00KHRCT-ND; Supplier Part Number 2: P1.00KHCT-ND; Supplier Part Number 3: RMCF0603FG1K00CT-ND
R11 R12 = RES0603 10K 1% 1/10W: as R1#1 on sheet Main; Supplier 1: Digi-Key; Supplier 2: Digi-Key; Supplier 3: Digi-Key; Supplier Part Number 1: 311-10.0KHRCT-ND; Supplier Part Number 2: RMCF0603FT10K0CT-ND; Supplier Part Number 3: P10.0KHCT-ND; Value: 10K
R13 = RES0603 2.43K 1% 1/10W: SMT 0603 Ceramic Resistor; Power: 1/10W; Tolerance: 1%; Value: 2.43K; Supplier 1: Digi-Key; Supplier 2: Mouser; Supplier Part Number 1: 311-2.43KHRDKR-ND; Supplier Part Number 2: 603-RC0603FR-072K43L
R14 = RES0603 4.32K 1% 1/10W: SMT 0603 Ceramic Resistor; Power: 1/10W; Tolerance: 1%; Value: 4.32K; Supplier 1: Digi-Key; Supplier 2: Digi-Key; Supplier 3: Digi-Key; Supplier Part Number 1: 311-4.32KHRTR-ND; Supplier Part Number 2: P4.32KHCT-ND; Supplier Part Number 3: CRCW06034K32FKEB-ND
R15 = RES0603 2.2K 1% 1/10W: SMT 0603 Ceramic Resistor; Power: 1/10W; Tolerance: 1%; Value: 2.2K; Supplier 1: Digi-Key; Supplier Part Number 1: 311-2.20KHRCT-ND
R16 = RES0603 1.5K 1% 1/10W: SMT 0603 Ceramic Resistor; Power: 1/10W; Tolerance: 1%; Value: 1.5k; Supplier 1: Digi-Key; Supplier 2: Digi-Key; Supplier Part Number 1: 311-1.50KHRCT-ND; Supplier Part Number 2: RMCF0603FT1K50CT-ND
R17 = RES0603 100K 1% 1/10W: as R?#1 on sheet Power; Value: 100K; Supplier 1: Digi-Key; Supplier Part Number 1: 311-100KHRCT-ND
U3 = LMV793MF/NOPB: TI LMV793MF/NOPB 88MHz Single OP-Amp; Slew Rate: 35 V/us; Bandwidth: 88MHz; Supplier 1: Digi-Key; Supplier Part Number 1: LMV793MF/NOPBCT-ND
U4 = SN65176B: Half Duplex RS485 Tranceiver; Supplier 1: Digi-Key; Supplier 2: Mouser; Supplier Part Number 1: 296-14636-1-ND; Supplier Part Number 2: 595-SN65176BDR

## Sheet UI.SchDoc: User Interface
size A; Author: Craig Hesling; DrawnBy: Craig Hesling; Revision: 1
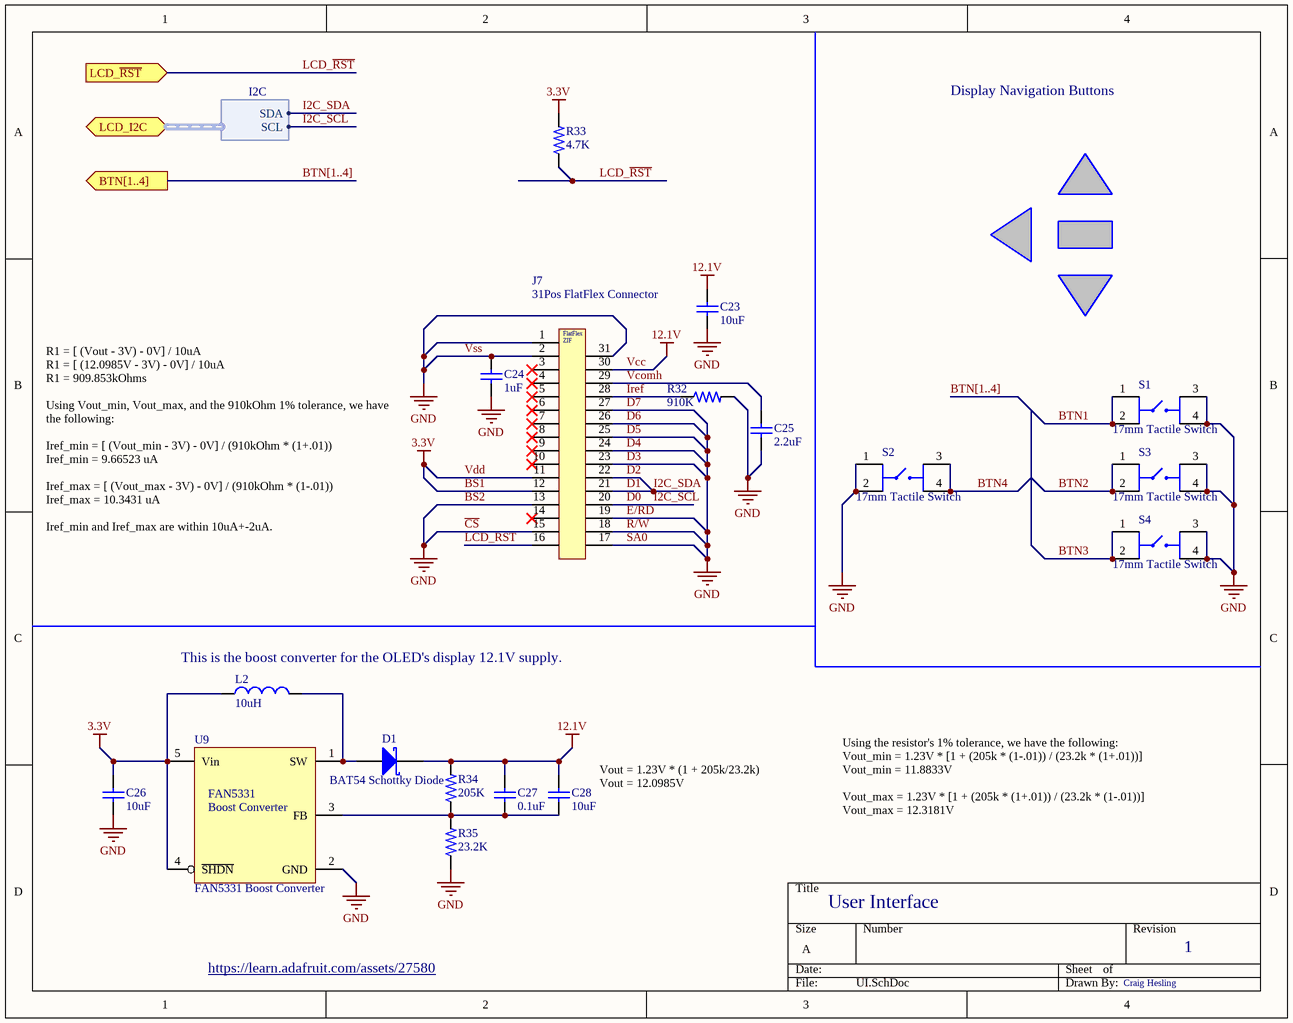
[diagram p5: UI.SchDoc]

### Parts
(Parts that share a designator on the sheet are numbered #1, #2 ... from top to bottom, then left to right.)
C23  10uF  [CAPC3216X18L - CAP1206 1.8MM TALL]
C24  1uF  [CAPC1608X09L - CAP0603]
C25  2.2uF  [CAPC1608X09L - CAP0603]
C26  10uF  [CAPC2013X14L - CAP0805 1.45mm Tall]
C27  0.1uF  [CAPC1608X09L - CAP0603]
C28  10uF  [CAPC3216X18L - CAP1206 1.8MM TALL]
D1#1  BAT54 Schottky Diode  [SOT95P240X120-3L - ON Semi]
J7  31Pos FlatFlex Connector  [31 Position Flat Flex ZIF Connector]
L2  10uH  [INDP4949X20L]
R32  910K  [RESC1608X06L - RES0603]
R33  4.7K  [RESC1608X06L - RES0603]
R34  205K  [RESC1608X06L - RES0603]
R35  23.2K  [RESC1608X06L - RES0603]
S1  17mm Tactile Switch  [TactileSwitchTE17mm]
S2  17mm Tactile Switch  [TactileSwitchTE17mm]
S3  17mm Tactile Switch  [TactileSwitchTE17mm]
S4  17mm Tactile Switch  [TactileSwitchTE17mm]
U9  FAN5331 Boost Converter  [SOT95P280X145-5L - ON Semi]

### Ports
BTN[1..4] (out), LCD_I2C (harness I2C), LCD_~{RST} (in)

### Harnesses
I2C: SDA, SCL

### Nets
BS1: C26.2 J7.11 J7.12 L2.1 R33.2 U9.4(~{SHDN}) U9.5(Vin)  [also labelled 3.3V, Vdd]
BS2: C23.1 C24.1 C24.2 C25.1 C26.1 J7.1 J7.2 J7.13 J7.15 J7.17 J7.18 J7.19 J7.23 J7.24 J7.25 J7.26 J7.27 J7.31 R32.2 R35.1 S1.3 S1.4 S2.1 S2.2 S3.3 S3.4 S4.3 S4.4 U9.2(GND)  [also labelled ~{CS}, D3, D4, D5, D6, D7, ~{E/RD}, GND, ~{R/W}, SA0, Vss]
Vcc: C23.2 C27.2 C28.2 D1#1.3(K) J7.30 R34.2  [also labelled 12.1V]
BTN1: S1.1 S1.2
BTN2: S3.1 S3.2
BTN3: S4.1 S4.2
BTN4: S2.3 S2.4
D0: J7.20 ; port LCD_I2C.SCL  [also labelled I2C_SCL]
D1: J7.21 J7.22 ; port LCD_I2C.SDA  [also labelled D2, I2C_SDA]
Iref: J7.28 R32.1
LCD_~{RST}: J7.16 R33.1 ; port LCD_~{RST}
Vcomh: C25.2 J7.29
NetC27_1: C27.1 C28.1 R34.1 R35.2 U9.3(FB)
NetD1#1_1: D1#1.1(A) L2.2 U9.1(SW)

Not connected (* = marked no-connect by the designer): J7 3* 4* 5* 6* 7* 8* 9* 10* 14*

### Buses and harness runs
bus BTN[1..4]
bus BTN[1..4] = port BTN[1..4]

### Notes on the sheet
- Display Navigation Buttons
- R1 = [ (Vout - 3V) - 0V] / 10uA
  R1 = [ (12.0985V - 3V) - 0V] / 10uA
  R1 = 909.853kOhms
  Using Vout_min, Vout_max, and the 910kOhm 1% tolerance, we have the following:
  Iref_min = [ (Vout_min - 3V) - 0V] / (910kOhm * (1+.01))
  Iref_min = 9.66523 uA
  Iref_max = [ (Vout_max - 3V) - 0V] / (910kOhm * (1-.01))
  Iref_max = 10.3431 uA
  Iref_min and Iref_max are within 10uA+-2uA.
- (near L2) This is the boost converter for the OLED's display 12.1V supply.
- (near C28) Vout = 1.23V * (1 + 205k/23.2k)
  Vout = 12.0985V
- Using the resistor's 1% tolerance, we have the following:
  Vout_min = 1.23V * [1 + (205k * (1-.01)) / (23.2k * (1+.01))]
  Vout_min = 11.8833V
  Vout_max = 1.23V * [1 + (205k * (1+.01)) / (23.2k * (1-.01))]
  Vout_max = 12.3181V
- https://learn.adafruit.com/assets/27580
- (in symbol 31 Position Flat Flex ZIF Connector) FlatFlex; ZIF
- (in symbol FAN5331) Boost Converter

### Library data of the parts
C23 C28 = CAP1206 10uF 10% 16V X5R: SMT 1206 Ceramic Capacitor; TempCoeff: X5R; Tolerance: 10%; Voltage: 16V; Value: 10uF; Supplier 1: Digi-Key; Supplier 2: Digi-Key; Supplier Part Number 1: 1276-1137-1-ND; Supplier Part Number 2: 490-10526-1-ND
C24 = CAP0603 1uF 5% 10V X7R: SMT 0603 Ceramic Capacitor; TempCoeff: X7R; Tolerance: 5%; Voltage: 10V; Value: 1uF; Supplier 1: Digi-Key; Supplier 2: Mouser; Supplier 3: Digi-Key; Supplier Part Number 1: 478-10074-1-ND; Supplier Part Number 2: 581-0603ZC105JAT2A; Supplier Part Number 3: 311-3484-1-ND
C25 = CAP0603 2.2uF 10% 6.3V X7R: SMT 0603 Ceramic Capacitor; TempCoeff: X7R; Tolerance: 10%; Voltage: 6.3V; Value: 2.2uF; Supplier 1: Digi-Key; Supplier 2: Digi-Key; Supplier Part Number 1: 1276-2017-1-ND; Supplier Part Number 2: 311-1795-1-ND
C26 = CAP0805 10uF 10% 6.3V X5R: as C4 on sheet Main; Value: 10uF; Supplier 1: Digi-Key; Supplier Part Number 1: 1276-6457-1-ND
C27 = CAP0603 0.1uF 10% 25V X7R: SMT 0603 Ceramic Capacitor; TempCoeff: X7R; Tolerance: 10%; Voltage: 25V; Value: 0.1uF; Supplier 1: Digi-Key; Supplier 2: Digi-Key; Supplier Part Number 1: 311-1341-1-ND; Supplier Part Number 2: 490-1524-1-ND
D1#1 = BAT54: ON Semi BAT54 800mV Schottky Diode; Vr: 30V; Vf: 800mV; Supplier 1: Digi-Key; Supplier 2: Mouser; Supplier Part Number 1: BAT54SLT1GOSCT-ND; Supplier Part Number 2: 512-BAT54
J7 = 31 Position Flat Flex ZIF Connector: TE 3-1734839-1 31 Position Flat Flex ZIF Connector; Positions: 31; Supplier 1: Digi-Key; Supplier Part Number 1: A101346CT-ND
L2 = INDWW 10uH 1.45A 20% 144mOhm 24MHz: SMT Wire Wound Inductor; Tolerance: 20%; Current Rating: 1.45A; Self Resonant: 24MHz; Value: 10uH; DC Resistance: 144mOhm; Supplier 1: Digi-Key; Supplier 2: Mouser; Supplier Part Number 1: 587-2409-1-ND; Supplier Part Number 2: 963-NRS5020T100MMGJ
R32 = RES0603 910K 1% 1/10W: SMT 0603 Ceramic Resistor; Power: 1/10W; Tolerance: 1%; Value: 910K; Supplier 1: Digi-Key; Supplier 2: Digi-Key; Supplier 3: Digi-Key; Supplier Part Number 1: 311-910KHRCT-ND; Supplier Part Number 2: P910KHCT-ND; Supplier Part Number 3: RMCF0603FT910KCT-ND
R33 = RES0603 4.7K 1% 1/10W: as R4 on sheet Main; Value: 4.7K; Supplier 1: Digi-Key; Supplier 2: Digi-Key; Supplier 3: Digi-Key; Supplier Part Number 1: 311-4.70KHRCT-ND; Supplier Part Number 2: P4.70KHCT-ND; Supplier Part Number 3: RMCF0603FT4K70CT-ND
R34 = RES0603 205K 1% 1/10W: SMT 0603 Ceramic Resistor; Power: 1/10W; Tolerance: 1%; Value: 205K; Supplier 1: Digi-Key; Supplier 2: Digi-Key; Supplier 3: Digi-Key; Supplier Part Number 1: 311-205KHRCT-ND; Supplier Part Number 2: P205KHCT-ND; Supplier Part Number 3: 541-205KHCT-ND
R35 = RES0603 23.2K 1% 1/10W: SMT 0603 Ceramic Resistor; Power: 1/10W; Tolerance: 1%; Value: 23.2K; Supplier 1: Digi-Key; Supplier 2: Digi-Key; Supplier 3: Digi-Key; Supplier Part Number 1: 311-23.2KHRCT-ND; Supplier Part Number 2: 541-23.2KHCT-ND; Supplier Part Number 3: RMCF0603FG23K2CT-ND
S1-S4 = TE 3-1825910-1 17mm Tactile Switch: Supplier 1: Digi-Key; Supplier Part Number 1: 450-1643-ND
U9 = FAN5331: ON Semi FAN5531 Boost Converter; Supplier 1: Digi-Key; Supplier 2: Mouser; Supplier Part Number 1: FAN5331SXCT-ND; Supplier Part Number 2: 512-FAN5331SX

## Sheet LoRa.SchDoc: LoRa
size A; Author: Craig Hesling; DrawnBy: Craig Hesling; Revision: 1
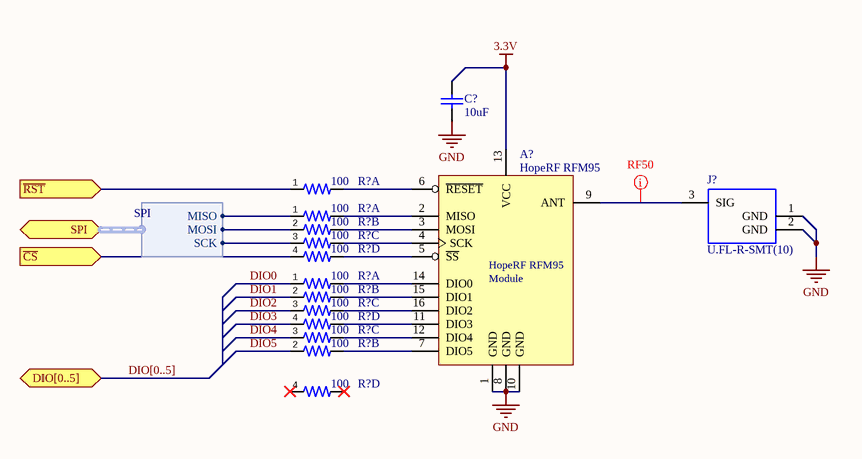
[diagram p6: LoRa.SchDoc]

### Parts
(Parts that share a designator on the sheet are numbered #1, #2 ... from top to bottom, then left to right.)
A?#1  HopeRF RFM95  [RFM95/9697/98W]
C?#7  10uF  [CAPC2013X14L - CAP0805 1.45mm Tall]
J?  U.FL-R-SMT(10)  [HRS-U.FL-R-SMT_V]
R?#8  100  [CAC-80P319X159-8L]  (part A of 4)
R?#9  100  [CAC-80P319X159-8L]  (part A of 4)
R?#10  100  [CAC-80P319X159-8L]  (part B of 4)
R?#11  100  [CAC-80P319X159-8L]  (part C of 4)
R?#12  100  [CAC-80P319X159-8L]  (part D of 4)
R?#13  100  [CAC-80P319X159-8L]  (part A of 4)
R?#14  100  [CAC-80P319X159-8L]  (part B of 4)
R?#15  100  [CAC-80P319X159-8L]  (part C of 4)
R?#16  100  [CAC-80P319X159-8L]  (part D of 4)
R?#17  100  [CAC-80P319X159-8L]  (part C of 4)
R?#18  100  [CAC-80P319X159-8L]  (part B of 4)
R?#19  100  [CAC-80P319X159-8L]  (part D of 4)

### Ports
DIO[0..5] (bidir), SPI (harness SPI), ~{CS} (in), ~{RST} (in)

### Harnesses
SPI: MISO, MOSI, SCK

### Nets
3.3V: A?#1.13(VCC) C?#7.2  [project net BS1]
GND: A?#1.1(GND) A?#1.8(GND) A?#1.10(GND) C?#7.1 J?.1(GND) J?.2(GND)  [project net BS2]
DIO0: R?#13.1
DIO1: R?#14.2
DIO2: R?#15.3
DIO3: R?#16.4
DIO4: R?#17.3
DIO5: R?#18.2
LoRa_~{RST}: R?#8.1 ; port ~{RST}
MISO: R?#9.1 ; port SPI.MISO
MOSI: R?#10.2 ; port SPI.MOSI
SCK: R?#11.3 ; port SPI.SCK
SPI_~{CS1}: R?#12.4 ; port ~{CS}
NetA?#1_2: A?#1.2(MISO) R?#9.5
NetA?#1_3: A?#1.3(MOSI) R?#10.6
NetA?#1_4: A?#1.4(SCK) R?#11.7
NetA?#1_5: A?#1.5(~{SS}) R?#12.8
NetA?#1_6: A?#1.6(~{RESET}) R?#8.5
NetA?#1_7: A?#1.7(DIO5) R?#18.6
NetA?#1_9: A?#1.9(ANT) J?.3(SIG)
NetA?#1_11: A?#1.11(DIO3) R?#16.8
NetA?#1_12: A?#1.12(DIO4) R?#17.7
NetA?#1_14: A?#1.14(DIO0) R?#13.5
NetA?#1_15: A?#1.15(DIO1) R?#14.6
NetA?#1_16: A?#1.16(DIO2) R?#15.7

Not connected (* = marked no-connect by the designer): R?#19 4* 8*

### Buses and harness runs
bus DIO[0..5] = port DIO[0..5]

### Layout directives
net class RF50: NetA?#1_9

### Notes on the sheet
- (in symbol RFM95) Module

### Library data of the parts
A?#1 = RFM95: HopeRF RFM95 915MHz LoRa Radio; Supplier 1: Digi-Key; Supplier 2: Digi-Key; Supplier Part Number 1: 1597-1488-ND; Supplier Part Number 2: RFM95W-915S2-ND
C?#7 = CAP0805 10uF 10% 6.3V X5R: as C4 on sheet Main; Value: 10uF; Supplier 1: Digi-Key; Supplier Part Number 1: 1276-6457-1-ND
J? = CMP-0029-00003-1: as J5 on sheet GPS; DatasheetVersion: Aug-16; Mount: Through Hole; Contact Material: Bronze; Length: 101.19 mm; Radiation Hardening: No; Height: 8.13 mm; ComponentLink1Description: Manufacturer URL; Pins: 80; Package Quantity: 50; ComponentLink2URL: https://www.hirose.com/product/en/download_file/key_name/U.FL/category/Catalog/doc_file_id/31697/?file_category_id=4&item_id=15&is_series=1; Lead Pitch: 2.54 mm; Max Operating Temperature: 105degC; Width: 4.88 mm; RoHSCompliant: True; Contact Plating: Tin; PackageReference: U.FL-R-SMT; Packaging: Bulk; Contact Finish: Lead; PackageDescription: 3-Pin Surface Mount Device, Body 2.6 x 2.6 mm; Min Operating Temperature: -65degC; ComponentLink1URL: https://www.hirose.com; ComponentLink2Description: Datasheet; Colour: Black
R?#8-R?#19 = RESARR1206 100 5% 1/16W: Tolerance: 5%; Power: 1/16W; Supplier 1: Digi-Key; Supplier Part Number 1: YC164J-100CT-ND; Value: 100

## Sheet RelayBoard.SchDoc
size A
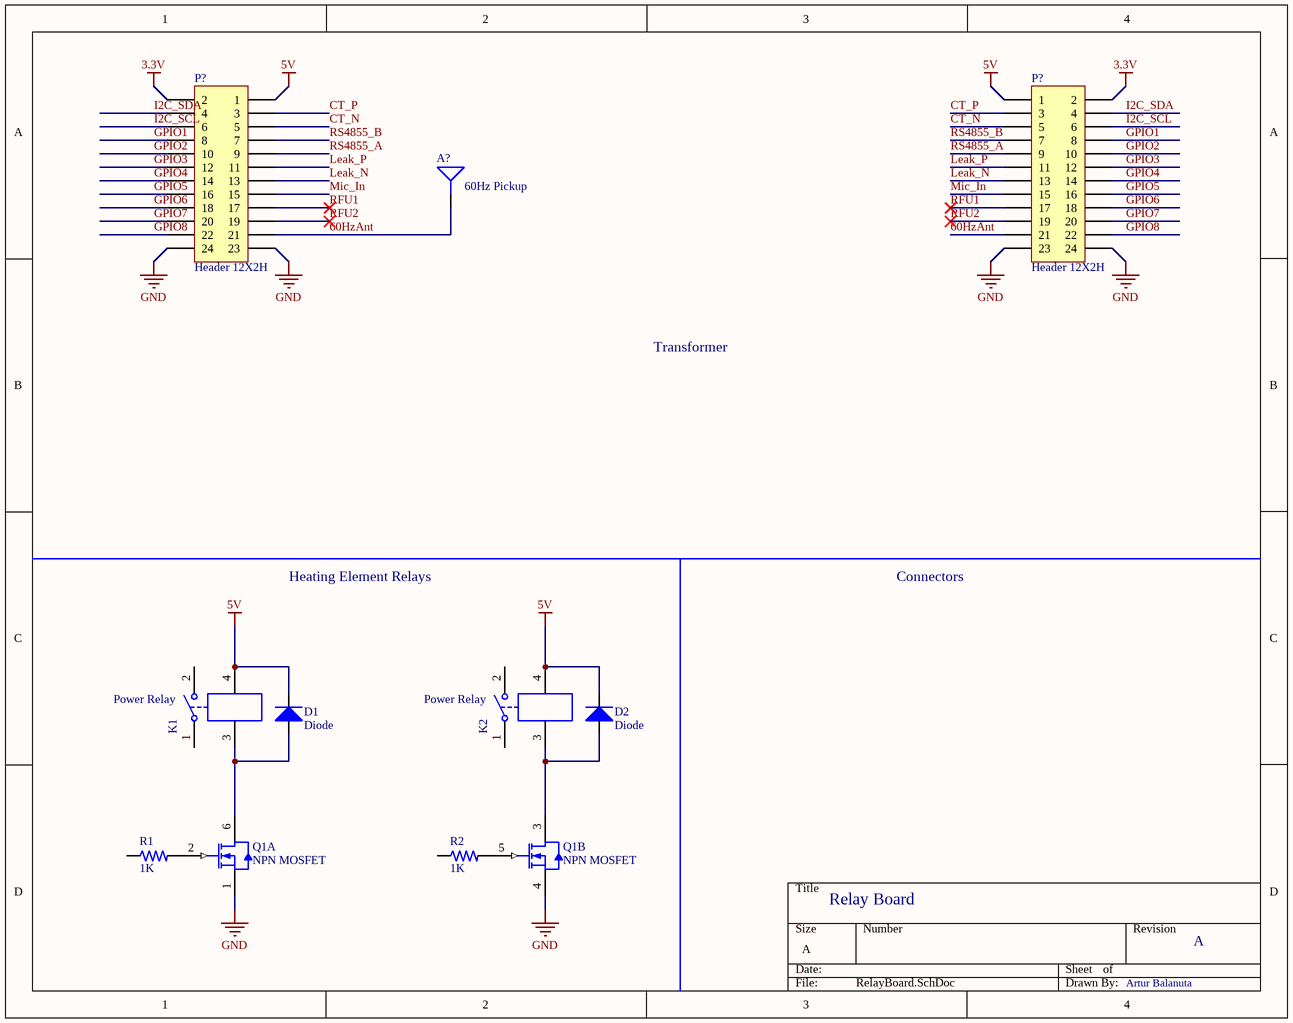
[diagram p7: RelayBoard.SchDoc]

### Parts
(Parts that share a designator on the sheet are numbered #1, #2 ... from top to bottom, then left to right.)
A?#2  60Hz Pickup  [60HzPickup]
D1#2  Diode  [SOD-80  MiniMELF]
D2  Diode  [SOD-80  MiniMELF]
K1  Power Relay  [T9AS1D12-5]
K2  Power Relay  [T9AS1D12-5]
P?#1  Header 12X2H  [HDR2X12H]
P?#2  Header 12X2H  [HDR2X12H]
Q1#2  NPN MOSFET  [SC-70-6  (SOT-363)]  (parts A,B of 2)
R1#2  1K  [RESC1608X06L - RES0603]
R2#2  1K  [RESC1608X06L - RES0603]

### Nets
3.3V: P?#1.2 P?#2.2  [project net BS1]
5V: D1#2.1(K) D2.1(K) K1.4 K2.4 P?#1.1 P?#2.1
GND: P?#1.23 P?#1.24 P?#2.23 P?#2.24 Q1#2.1(S1) Q1#2.4(S2)  [project net BS2]
60HzAnt: A?#2.1(Ant) P?#1.21 P?#2.21
CT_N: P?#1.5 P?#2.5
CT_P: P?#1.3 P?#2.3
GPIO1: P?#1.8 P?#2.8
GPIO2: P?#1.10 P?#2.10
GPIO3: P?#1.12 P?#2.12
GPIO4: P?#1.14 P?#2.14
GPIO5: P?#1.16 P?#2.16
GPIO6: P?#1.18 P?#2.18
GPIO7: P?#1.20 P?#2.20
GPIO8: P?#1.22 P?#2.22
I2C_SCL: P?#1.6 P?#2.6
I2C_SDA: P?#1.4 P?#2.4
Leak_N: P?#1.13 P?#2.13
Leak_P: P?#1.11 P?#2.11
Mic_In: P?#1.15 P?#2.15
RFU1: P?#1.17 P?#2.17
RFU2: P?#1.19 P?#2.19
RS4855_A: P?#1.9 P?#2.9
RS4855_B: P?#1.7 P?#2.7
NetD1#2_2: D1#2.2(A) K1.3 Q1#2.6(D1)
NetD2_2: D2.2(A) K2.3 Q1#2.3(D2)
NetQ1#2_2: Q1#2.2(G1) R1#2.2
NetQ1#2_5: Q1#2.5(G2) R2#2.2

Not connected (* = marked no-connect by the designer): K1 1 2; K2 1 2; R1#2 1; R2#2 1

### Notes on the sheet
- Transformer
- Heating Element Relays
- Connectors
- Relay Board
- A
- Artur Balanuta

### Library data of the parts
A?#2 = 60Hz pickup with via: as A2 on sheet Main
D1#2 D2 = Diode LL4150GS18: DIODE GEN 50V 600MA MINI MELF; Supplier 1: Digi-Key; Supplier Part Number 1: LL4150GS18GICT-ND
K1 K2 = T9AS1D12-5: Single-Pole Single-Throw Relay; Supplier 1: Digi-Key; Supplier Part Number 1: PB1014-ND; Part Number: T9AS1D12-5
P?#1 P?#2 = Header 12X2H: Header, 12-Pin, Dual row, Right Angle; LatestRevisionDate: 17-Jul-2002; LatestRevisionNote: Re-released for DXP Platform.; Publisher: Altium Limited
Q1#2 = SI1922EDH-T1-GE3CT: 2N-CH NPN MOSFET 20V 1.3A SOT-363; Supplier 1: Digi-Key; Supplier Part Number 1: SI1922EDH-T1-GE3CT-ND
R1#2 R2#2 = RES0603 1K 1% 1/10W: as R27 on sheet GPS; Value: 1K; Supplier 1: Digi-Key; Supplier 2: Digi-Key; Supplier 3: Digi-Key; Supplier Part Number 1: 311-1.00KHRCT-ND; Supplier Part Number 2: P1.00KHCT-ND; Supplier Part Number 3: RMCF0603FG1K00CT-ND

## Nets that join several sheets
5V: Main (P1.2 P1.4), Power (C?#1.2 U?#2.3), Accessories (C7.2 JP1.3 P2.1 U4.8), RelayBoard (6 pins)
BS1: Main (10 pins), GPS (C20.2 R27.2 U8.22 U8.23), Power (6 pins), Accessories (7 pins), UI (7 pins), LoRa (A?#1.13 C?#7.2), RelayBoard (P?#1.2 P?#2.2)
BS2: Main (23 pins), GPS (11 pins), UART (10 pins), Power (7 pins), Accessories (13 pins), UI (29 pins), LoRa (6 pins), RelayBoard (6 pins)
60Hz: Main (A1.10 P1.22), Power (U?#4.7)
60HzAnt: Main (A2.1), Power (C?#3.1), Accessories (P2.21)
BTN1: Main (U1.21), UI (S1.1 S1.2)
BTN2: Main (U1.22), UI (S3.1 S3.2)
BTN3: Main (U1.23), UI (S4.1 S4.2)
BTN4: Main (U1.24), UI (S2.3 S2.4)
~{CS}: Main (A1.29), GPS (FB2.1)
CT: Main (A1.4), Accessories (J2.2 P2.3 R8.2)
D0: Main (A1.7 P1.5 R5.1 U1.12), Accessories (P2.6), UI (J7.20)
D1: Main (A1.6 P1.3 R4.1 U1.13), Accessories (P2.4), UI (J7.21 J7.22)
DIO0: Main (U1.3), LoRa (R?#13.1)
DIO1: Main (U1.4), LoRa (R?#14.2)
DIO2: Main (U1.5), LoRa (R?#15.3)
DIO3: Main (U1.6), LoRa (R?#16.4)
DIO4: Main (U1.7), LoRa (R?#17.3)
DIO5: Main (U1.8), LoRa (R?#18.2)
FTDI_RX: Main (A1.35 P1.10 TP4.1), UART (U7.2)
FTDI_TX: Main (A1.34 P1.8 TP3.1), UART (U7.30)
GPIO1: Main (A1.14), Accessories (P2.8)
GPIO2: Main (A1.16), Accessories (P2.10)
GPIO3: Main (A1.13), Accessories (P2.12)
GPIO4: Main (A1.23), Accessories (P2.14)
GPIO5: Main (U1.25), Accessories (P2.16)
GPIO6: Main (U1.26), Accessories (P2.18)
GPIO7: Main (U1.27), Accessories (P2.20)
GPIO8: Main (U1.28), Accessories (P2.22)
GPS_PPS: Main (A1.11 P1.32), GPS (U8.3)
IO0: Main (A1.25 P1.16 R1#1.1 TP1.1), UART (Q1#1.1)
LCD_~{RST}: Main (U1.2), UI (J7.16 R33.1)
Leak: Main (A1.5), Accessories (J1.1 P2.13 R7.2)
LoRa_~{RST}: Main (U1.1), LoRa (R?#8.1)
MCU_EN: Main (A1.3 P1.18 R2#1.1 TP2.1), UART (Q1#1.3)
Mic: Main (A1.12), Accessories (JP2.2)
MISO: Main (A1.31), GPS (FB4.1), LoRa (R?#9.1)
MOSI: Main (A1.37), GPS (FB5.1), LoRa (R?#10.2)
RS485.D: Main (A1.28), Accessories (U4.4)
RS485.DE: Main (A1.36), Accessories (U4.2 U4.3)
RS485.R: Main (A1.27), Accessories (R13.1 R14.2)
SCK: Main (A1.30), GPS (FB3.1), LoRa (R?#11.3)
SPI_~{CS1}: Main (A1.33), LoRa (R?#12.4)